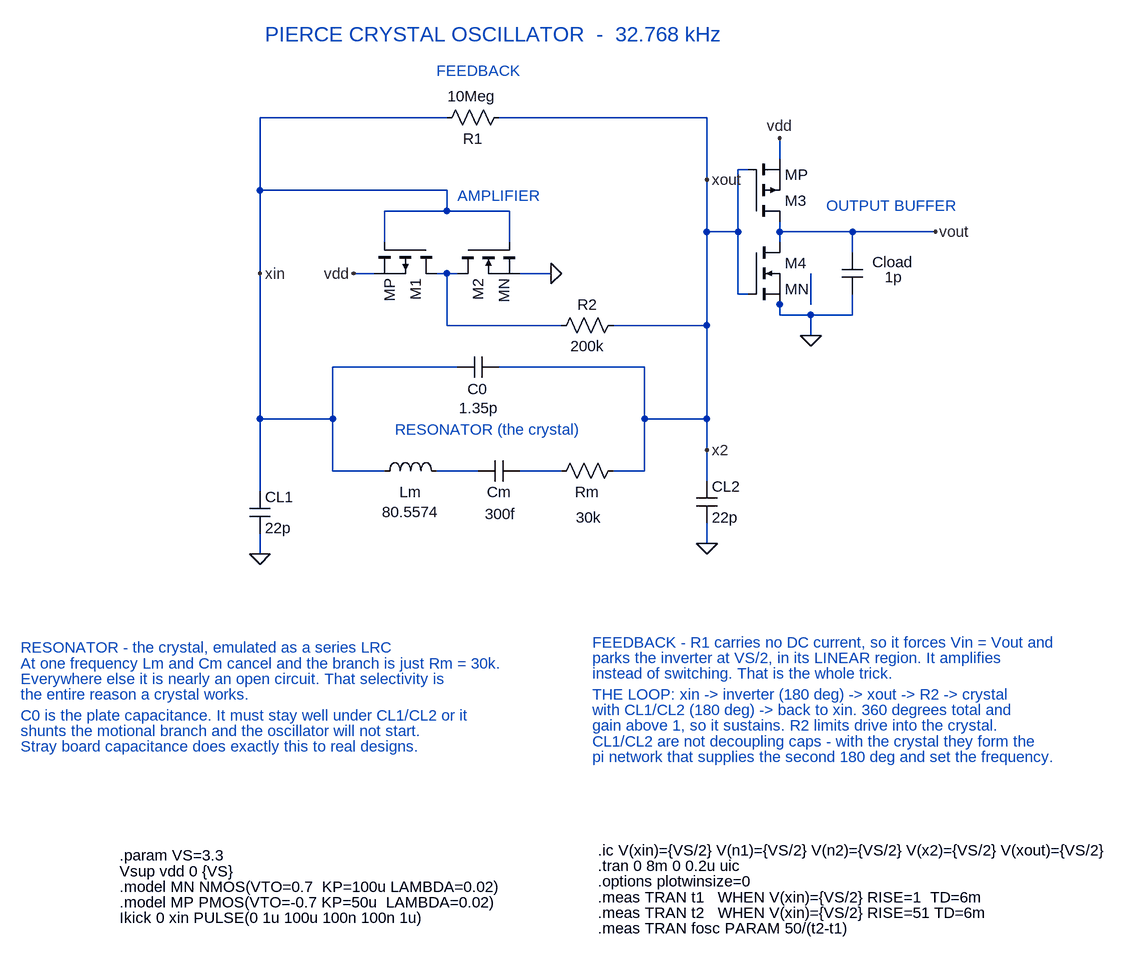
[diagram p0: schematic pierce_cmos.asc]
pierce_cmos.asc, the LTspice schematic file:
Version 4.1
SHEET 1 1628 1552
WIRE 400 96 112 96
WIRE 800 96 480 96
WIRE 912 160 912 128
WIRE 864 176 848 176
WIRE 800 192 800 96
WIRE 112 208 112 96
WIRE 400 208 112 208
WIRE 400 240 400 208
WIRE 400 240 304 240
WIRE 496 240 400 240
WIRE 800 272 800 192
WIRE 848 272 848 176
WIRE 848 272 800 272
WIRE 912 272 912 256
WIRE 1024 272 912 272
WIRE 1152 272 1024 272
WIRE 304 288 304 240
WIRE 496 288 496 240
WIRE 912 288 912 272
WIRE 1024 304 1024 272
WIRE 112 336 112 208
WIRE 288 336 256 336
WIRE 400 336 384 336
WIRE 416 336 400 336
WIRE 560 336 512 336
WIRE 848 368 848 272
WIRE 864 368 848 368
WIRE 912 384 912 352
WIRE 960 384 960 336
WIRE 912 400 912 384
WIRE 960 400 912 400
WIRE 1024 400 1024 368
WIRE 1024 400 960 400
WIRE 400 416 400 336
WIRE 576 416 400 416
WIRE 800 416 800 272
WIRE 800 416 656 416
WIRE 960 432 960 400
WIRE 416 480 224 480
WIRE 704 480 480 480
WIRE 112 560 112 336
WIRE 224 560 224 480
WIRE 224 560 112 560
WIRE 704 560 704 480
WIRE 800 560 800 416
WIRE 800 560 704 560
WIRE 800 608 800 560
WIRE 224 640 224 560
WIRE 304 640 224 640
WIRE 448 640 384 640
WIRE 576 640 512 640
WIRE 704 640 704 560
WIRE 704 640 656 640
WIRE 800 656 800 608
WIRE 112 672 112 560
WIRE 800 752 800 720
WIRE 112 768 112 736
FLAG 112 336 xin
FLAG 800 608 x2
FLAG 800 192 xout
FLAG 1152 272 vout
FLAG 256 336 vdd
FLAG 912 128 vdd
FLAG 560 336 0
FLAG 112 768 0
FLAG 800 752 0
FLAG 960 432 0
SYMBOL res 384 112 R270
WINDOW 0 -32 56 VTop 2
WINDOW 3 64 54 VBottom 2
SYMATTR InstName R1
SYMATTR Value 10Meg
SYMBOL pmos 384 288 R90
SYMATTR InstName M1
SYMATTR Value MP
SYMATTR Value2 l=760u w=320u
SYMBOL nmos 416 288 M90
SYMATTR InstName M2
SYMATTR Value MN
SYMATTR Value2 l=760u w=160u
SYMBOL pmos 864 256 M180
SYMATTR InstName M3
SYMATTR Value MP
SYMATTR Value2 l=100u w=800u
SYMBOL nmos 864 288 R0
SYMATTR InstName M4
SYMATTR Value MN
SYMATTR Value2 l=100u w=400u
SYMBOL ind 288 656 R270
WINDOW 0 -32 56 VTop 2
WINDOW 3 -32 56 VBottom 2
SYMATTR InstName Lm
SYMATTR Value 80.5574
SYMBOL cap 448 656 R270
WINDOW 0 -32 32 VTop 2
WINDOW 3 -35 34 VBottom 2
SYMATTR InstName Cm
SYMATTR Value 300f
SYMBOL res 560 656 R270
WINDOW 0 -32 56 VTop 2
WINDOW 3 -40 58 VBottom 2
SYMATTR InstName Rm
SYMATTR Value 30k
SYMBOL cap 416 496 R270
WINDOW 0 -34 31 VTop 2
WINDOW 3 -32 33 VBottom 2
SYMATTR InstName C0
SYMATTR Value 1.35p
SYMBOL res 672 400 R90
WINDOW 0 0 56 VBottom 2
WINDOW 3 32 56 VTop 2
SYMATTR InstName R2
SYMATTR Value 200k
SYMBOL cap 96 672 R0
SYMATTR InstName CL1
SYMATTR Value 22p
SYMBOL cap 784 656 R0
SYMATTR InstName CL2
SYMATTR Value 22p
SYMBOL cap 1008 304 R0
WINDOW 0 47 15 Left 2
WINDOW 3 66 38 Left 2
SYMATTR InstName Cload
SYMATTR Value 1p
TEXT 120 -32 Left 3 ;PIERCE CRYSTAL OSCILLATOR  -  32.768 kHz
TEXT 384 24 Left 2 ;FEEDBACK
TEXT 416 216 Left 2 ;AMPLIFIER
TEXT 984 232 Left 2 ;OUTPUT BUFFER
TEXT 320 576 Left 2 ;RESONATOR (the crystal)
TEXT -256 912 Left 2 ;RESONATOR - the crystal, emulated as a series LRC
TEXT -256 936 Left 2 ;At one frequency Lm and Cm cancel and the branch is just Rm = 30k.
TEXT -256 960 Left 2 ;Everywhere else it is nearly an open circuit. That selectivity is
TEXT -256 984 Left 2 ;the entire reason a crystal works.
TEXT -256 1016 Left 2 ;C0 is the plate capacitance. It must stay well under CL1/CL2 or it
TEXT -256 1040 Left 2 ;shunts the motional branch and the oscillator will not start.
TEXT -256 1064 Left 2 ;Stray board capacitance does exactly this to real designs.
TEXT 624 904 Left 2 ;FEEDBACK - R1 carries no DC current, so it forces Vin = Vout and
TEXT 624 928 Left 2 ;parks the inverter at VS/2, in its LINEAR region. It amplifies
TEXT 624 952 Left 2 ;instead of switching. That is the whole trick.
TEXT 624 984 Left 2 ;THE LOOP: xin -> inverter (180 deg) -> xout -> R2 -> crystal
TEXT 624 1008 Left 2 ;with CL1/CL2 (180 deg) -> back to xin. 360 degrees total and
TEXT 624 1032 Left 2 ;gain above 1, so it sustains. R2 limits drive into the crystal.
TEXT 624 1056 Left 2 ;CL1/CL2 are not decoupling caps - with the crystal they form the
TEXT 624 1080 Left 2 ;pi network that supplies the second 180 deg and set the frequency.
TEXT -104 1232 Left 2 !.param VS=3.3
TEXT -104 1256 Left 2 !Vsup vdd 0 {VS}
TEXT -104 1280 Left 2 !.model MN NMOS(VTO=0.7  KP=100u LAMBDA=0.02)
TEXT -104 1304 Left 2 !.model MP PMOS(VTO=-0.7 KP=50u  LAMBDA=0.02)
TEXT -104 1328 Left 2 !Ikick 0 xin PULSE(0 1u 100u 100n 100n 1u)
TEXT 632 1224 Left 2 !.ic V(xin)={VS/2} V(n1)={VS/2} V(n2)={VS/2} V(x2)={VS/2} V(xout)={VS/2}
TEXT 632 1248 Left 2 !.tran 0 8m 0 0.2u uic
TEXT 632 1272 Left 2 !.options plotwinsize=0
TEXT 632 1296 Left 2 !.meas TRAN t1   WHEN V(xin)={VS/2} RISE=1  TD=6m
TEXT 632 1320 Left 2 !.meas TRAN t2   WHEN V(xin)={VS/2} RISE=51 TD=6m
TEXT 632 1344 Left 2 !.meas TRAN fosc PARAM 50/(t2-t1)

The netlist it stands for:
* pierce_cmos.asc
R1 xin xout 10Meg
M1 N001 xin vdd vdd MP l=760u w=320u
M2 N001 xin 0 0 MN l=760u w=160u
M3 vout xout vdd vdd MP l=100u w=800u
M4 vout xout 0 0 MN l=100u w=400u
Lm xin N003 80.5574
Cm N003 N004 300f
Rm N004 xout 30k
C0 xin xout 1.35p
R2 xout N001 200k
CL1 xin 0 22p
CL2 xout 0 22p
Cload vout 0 1p
.model NMOS NMOS
.model PMOS PMOS
.lib standard.mos
* PIERCE CRYSTAL OSCILLATOR  -  32.768 kHz
* FEEDBACK
* AMPLIFIER
* OUTPUT BUFFER
* RESONATOR (the crystal)
* RESONATOR - the crystal, emulated as a series LRC
* At one frequency Lm and Cm cancel and the branch is just Rm = 30k.
* Everywhere else it is nearly an open circuit. That selectivity is
* the entire reason a crystal works.
* C0 is the plate capacitance. It must stay well under CL1/CL2 or it
* shunts the motional branch and the oscillator will not start.
* Stray board capacitance does exactly this to real designs.
* FEEDBACK - R1 carries no DC current, so it forces Vin = Vout and
* parks the inverter at VS/2, in its LINEAR region. It amplifies
* instead of switching. That is the whole trick.
* THE LOOP: xin -> inverter (180 deg) -> xout -> R2 -> crystal
* with CL1/CL2 (180 deg) -> back to xin. 360 degrees total and
* gain above 1, so it sustains. R2 limits drive into the crystal.
* CL1/CL2 are not decoupling caps - with the crystal they form the
* pi network that supplies the second 180 deg and set the frequency.
.param VS=3.3
Vsup vdd 0 {VS}
.model MN NMOS(VTO=0.7  KP=100u LAMBDA=0.02)
.model MP PMOS(VTO=-0.7 KP=50u  LAMBDA=0.02)
Ikick 0 xin PULSE(0 1u 100u 100n 100n 1u)
.ic V(xin)={VS/2} V(n1)={VS/2} V(n2)={VS/2} V(x2)={VS/2} V(xout)={VS/2}
.tran 0 8m 0 0.2u uic
.options plotwinsize=0
.meas TRAN t1   WHEN V(xin)={VS/2} RISE=1  TD=6m
.meas TRAN t2   WHEN V(xin)={VS/2} RISE=51 TD=6m
.meas TRAN fosc PARAM 50/(t2-t1)
.backanno
.end